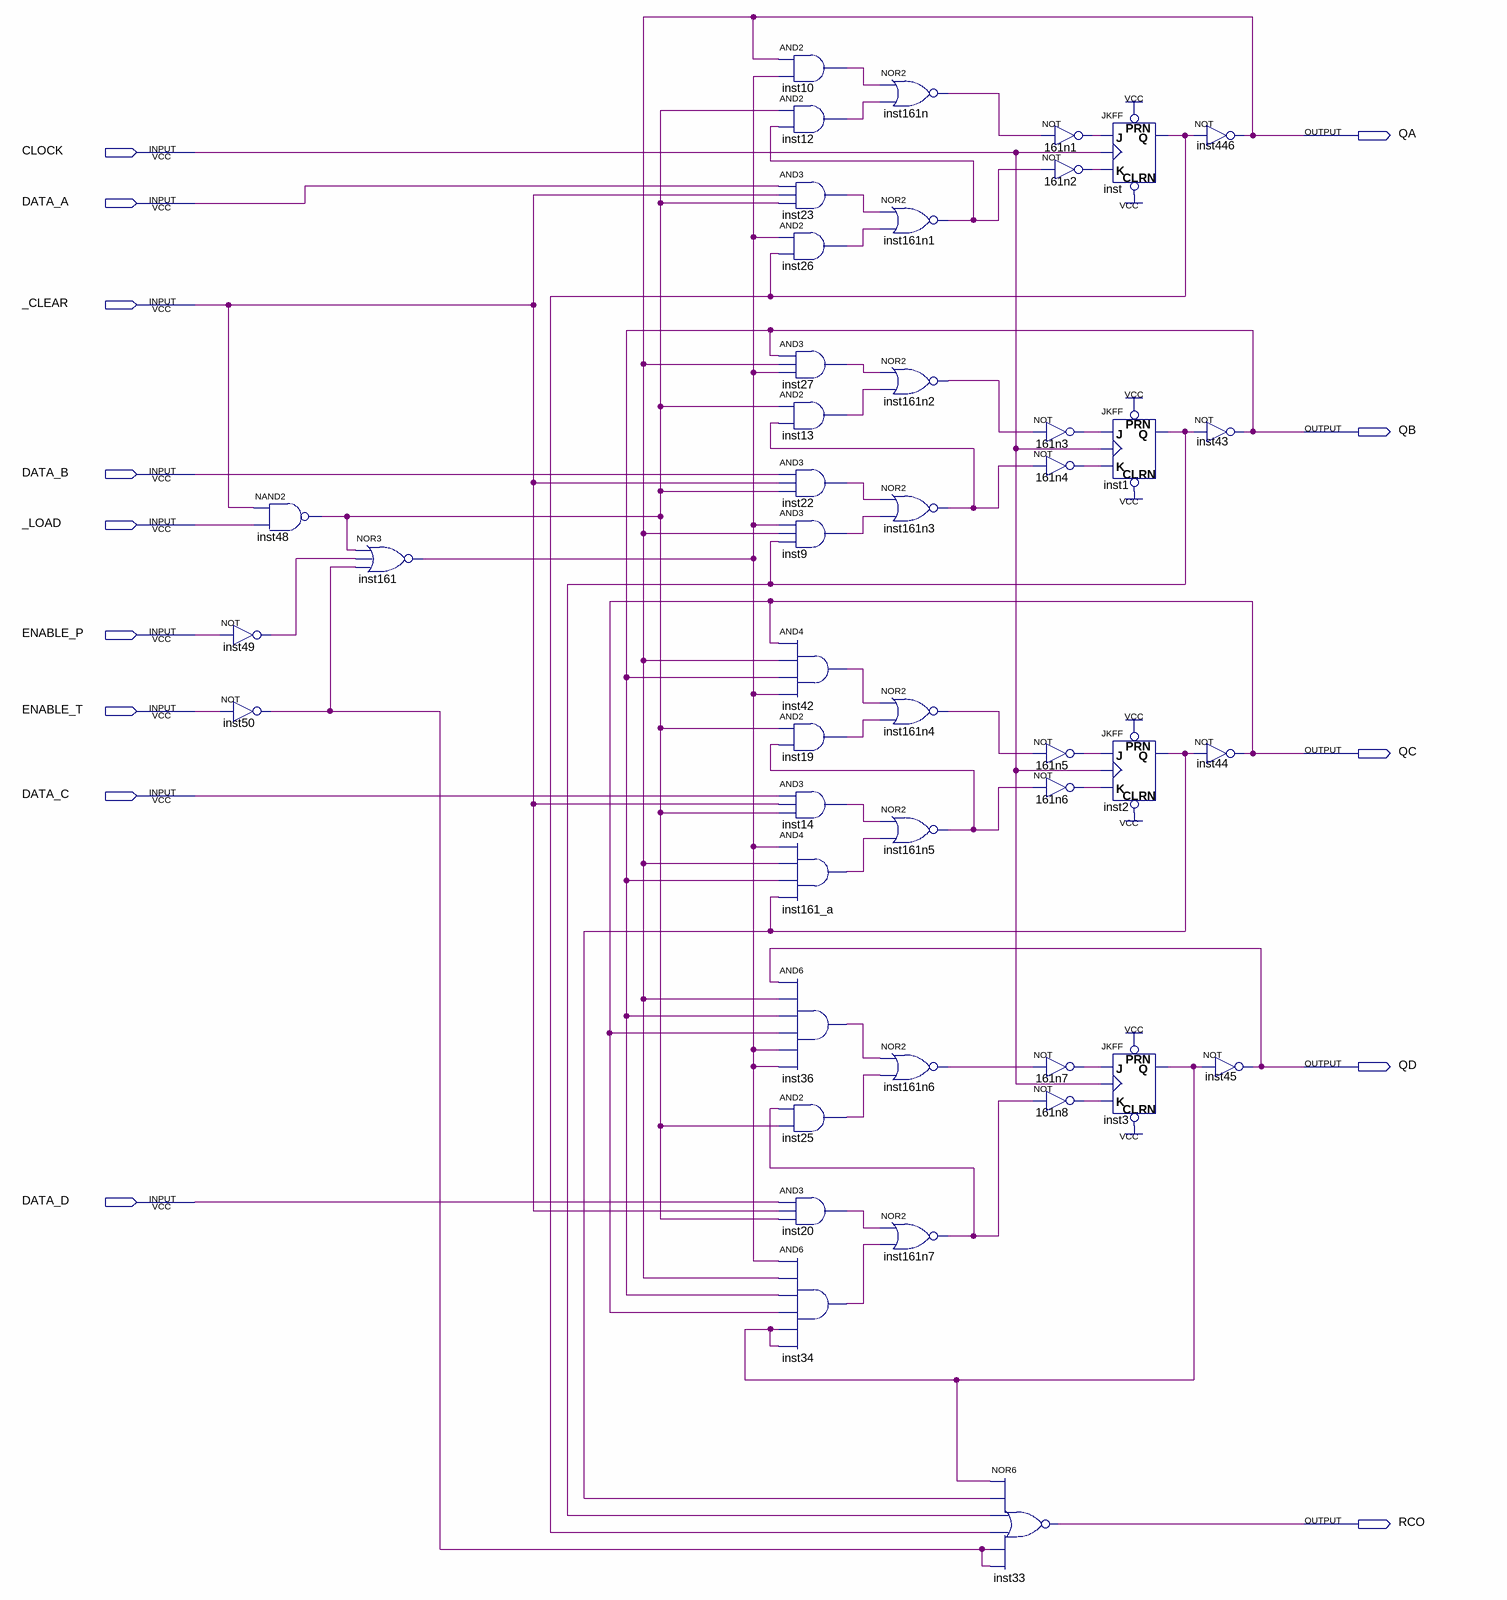
[diagram p0: schematic sheet]
// Quartus schematic DM74LS161A.bdf as structural Verilog: 45 symbols, 14 pins
module DM74LS161A (
  input  CLOCK,
  input  DATA_A,
  input  _CLEAR,
  input  DATA_B,
  input  _LOAD,
  input  ENABLE_P,
  input  ENABLE_T,
  input  DATA_C,
  input  DATA_D,
  output QA,
  output QB,
  output QC,
  output QD,
  output RCO
);

  wire inst1_q, inst2_q, inst3_q, inst9_out, inst10_out, inst12_out, inst13_out, inst14_out, inst19_out,
       inst20_out, inst22_out, inst23_out, inst25_out, inst26_out, inst27_out, inst34_out, inst36_out,
       inst42_out, inst48_out, inst49_out, inst50_out, inst161_a_out, inst161_out, inst161n1_out,
       inst161n2_out, inst161n3_out, inst161n4_out, inst161n5_out, inst161n6_out, inst161n7_out,
       inst161n_out, inst_q, n161n1_out, n161n2_out, n161n3_out, n161n4_out, n161n5_out, n161n6_out,
       n161n7_out, n161n8_out;

  not inst49 (inst49_out, ENABLE_P);
  not inst50 (inst50_out, ENABLE_T);
  nand inst48 (inst48_out, _CLEAR, _LOAD);
  nor inst161 (inst161_out, inst48_out, inst49_out, inst50_out);
  and inst10 (inst10_out, QA, inst161_out);
  and inst12 (inst12_out, inst48_out, inst161n1_out);
  and inst23 (inst23_out, DATA_A, _CLEAR, inst48_out);
  and inst26 (inst26_out, inst161_out, inst_q);
  and inst27 (inst27_out, QB, QA, inst161_out);
  and inst13 (inst13_out, inst48_out, inst161n3_out);
  and inst22 (inst22_out, DATA_B, _CLEAR, inst48_out);
  and inst9 (inst9_out, inst161_out, QA, inst1_q);
  and inst42 (inst42_out, QC, QA, QB, inst161_out);
  and inst19 (inst19_out, inst48_out, inst161n5_out);
  and inst14 (inst14_out, DATA_C, _CLEAR, inst48_out);
  and inst161_a (inst161_a_out, inst161_out, QA, QB, inst2_q);
  and inst36 (inst36_out, QD, QA, QB, QC, inst161_out, inst161_out);
  and inst25 (inst25_out, inst161n7_out, inst48_out);
  and inst20 (inst20_out, DATA_D, _CLEAR, inst48_out);
  and inst34 (inst34_out, inst161_out, QA, QB, QC, inst3_q, inst3_q);
  nor inst161n (inst161n_out, inst10_out, inst12_out);
  nor inst161n1 (inst161n1_out, inst23_out, inst26_out);
  nor inst161n2 (inst161n2_out, inst27_out, inst13_out);
  nor inst161n3 (inst161n3_out, inst22_out, inst9_out);
  nor inst161n4 (inst161n4_out, inst42_out, inst19_out);
  nor inst161n5 (inst161n5_out, inst14_out, inst161_a_out);
  nor inst161n6 (inst161n6_out, inst36_out, inst25_out);
  nor inst161n7 (inst161n7_out, inst20_out, inst34_out);
  not u_161n1 (n161n1_out, inst161n_out);
  not u_161n2 (n161n2_out, inst161n1_out);
  not u_161n3 (n161n3_out, inst161n2_out);
  not u_161n4 (n161n4_out, inst161n3_out);
  not u_161n5 (n161n5_out, inst161n4_out);
  not u_161n6 (n161n6_out, inst161n5_out);
  not u_161n7 (n161n7_out, inst161n6_out);
  not u_161n8 (n161n8_out, inst161n7_out);
  nor inst33 (RCO, inst3_q, inst2_q, inst1_q, inst_q, inst50_out, inst50_out);
  JKFF inst (.PRN(1'b1), .CLRN(1'b1), .K(n161n2_out), .J(n161n1_out), .CLK(CLOCK), .Q(inst_q));
  JKFF inst1 (.PRN(1'b1), .CLRN(1'b1), .K(n161n4_out), .J(n161n3_out), .CLK(CLOCK), .Q(inst1_q));
  JKFF inst2 (.PRN(1'b1), .CLRN(1'b1), .K(n161n6_out), .J(n161n5_out), .CLK(CLOCK), .Q(inst2_q));
  JKFF inst3 (.PRN(1'b1), .CLRN(1'b1), .K(n161n8_out), .J(n161n7_out), .CLK(CLOCK), .Q(inst3_q));
  not inst446 (QA, inst_q);
  not inst43 (QB, inst1_q);
  not inst44 (QC, inst2_q);
  not inst45 (QD, inst3_q);
endmodule
